# EAGLE design HV Board rev12 (EAGLE 9.6.2)
ENGINEER: Arvind Srinivasan

## Sheet 1 of 2: GLV Systems (Main IO, LEDs, Power, Current Sensors, AIRs, and BMS)
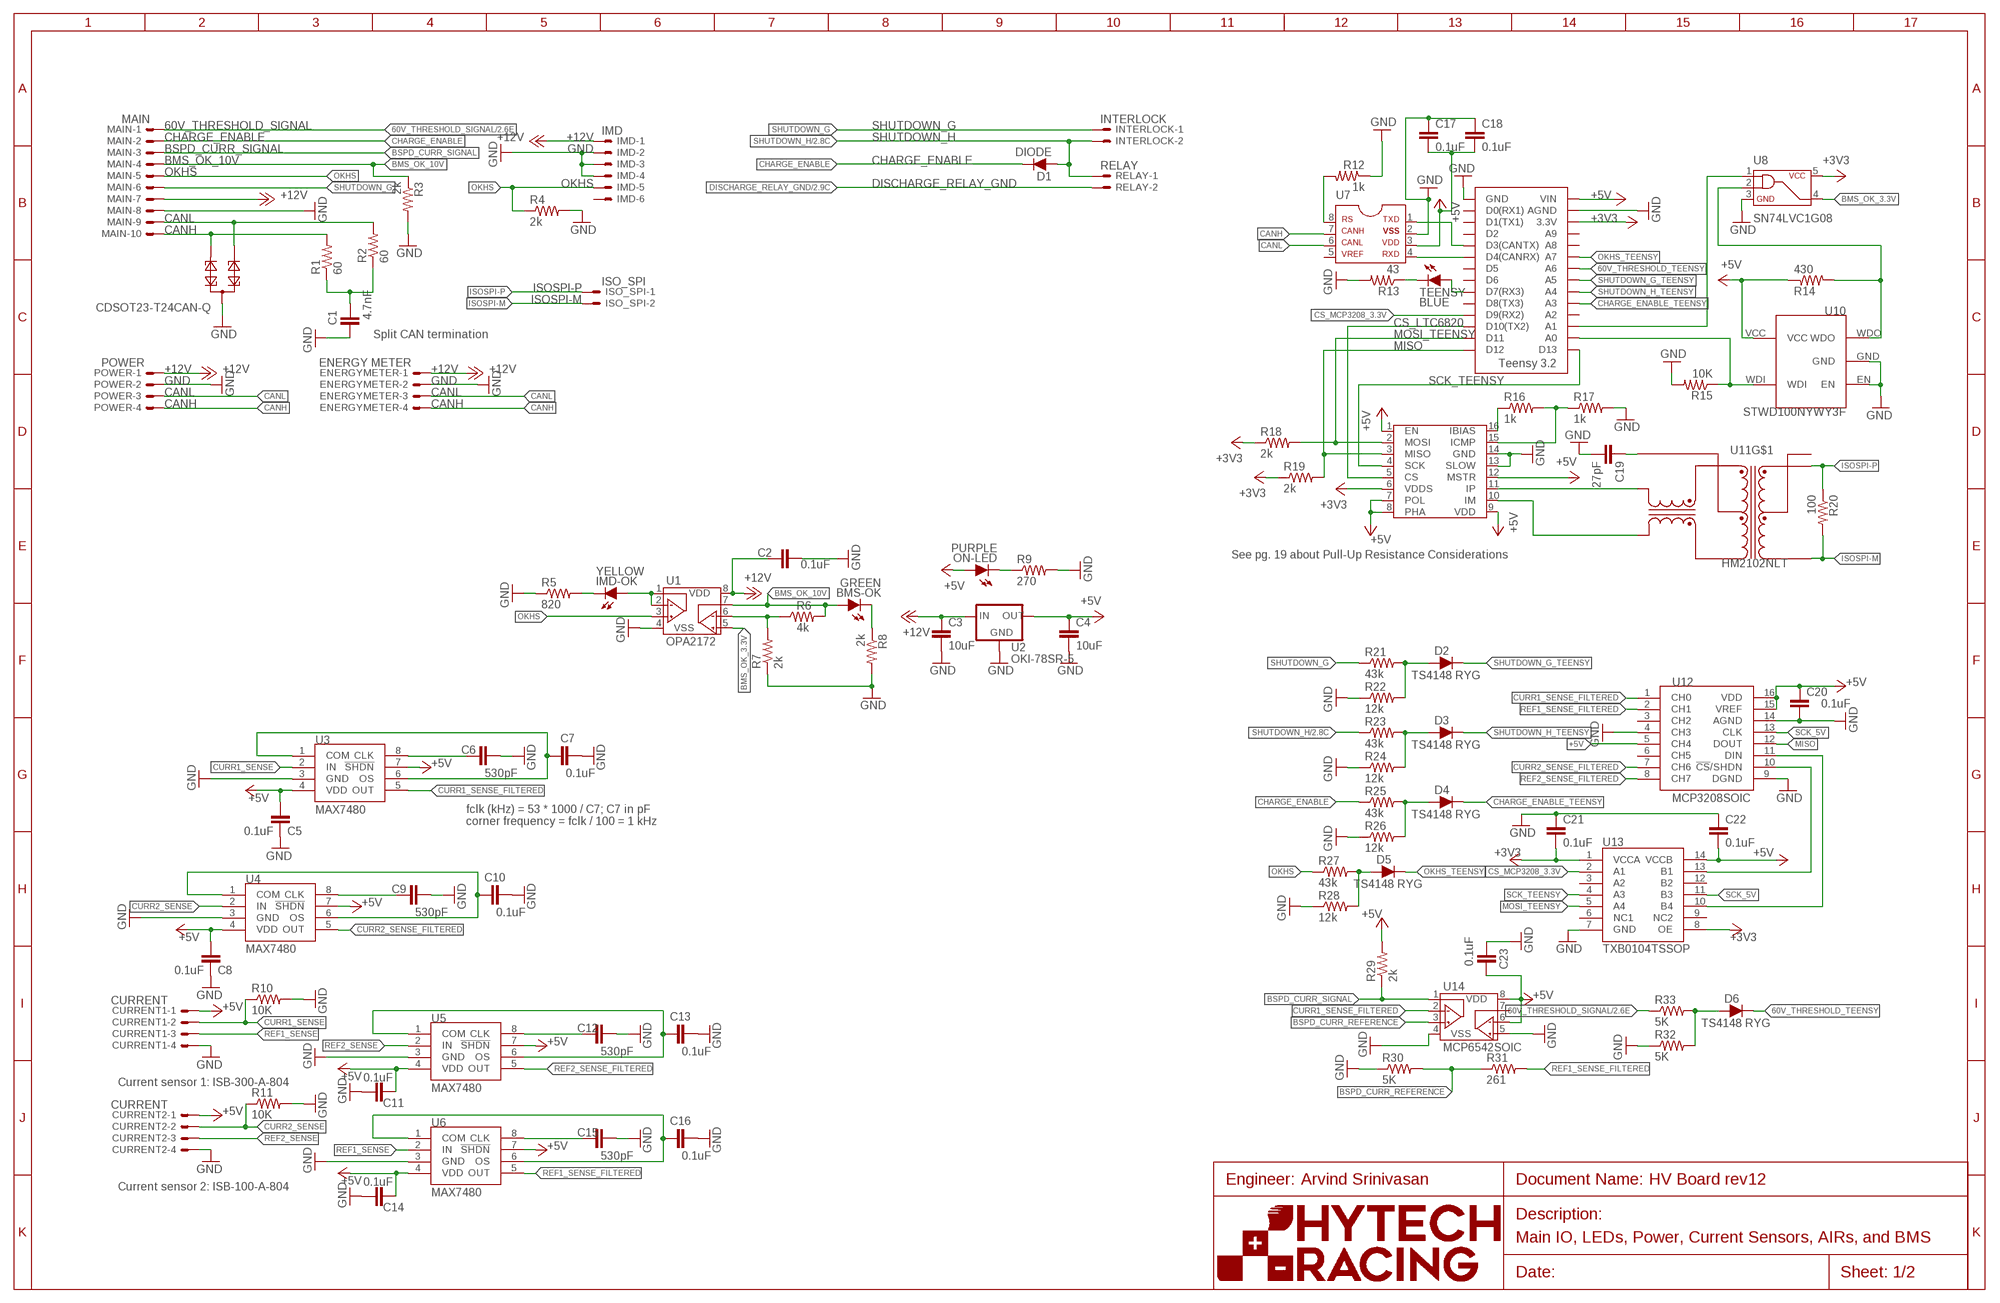
[diagram p0: schematic, sheet 1]
U$1 (FRAME_B): FRAME_DESCRIPTION: Main IO, LEDs, Power, Current Sensors, AIRs, and BMS; ORIENTATION: LANDSCAPE; SIZE: B

### Parts
BMS-OK  GREEN  LED-0805  [LED-805]
C1  4.7nF  CAP0603-CAP  [0603-CAP]
C2  0.1uF  CAP0603-CAP  [0603-CAP]
C3  10uF  CAP0603-CAP  [0603-CAP]
C4  10uF  CAP0603-CAP  [0603-CAP]
C5  0.1uF  CAP0603-CAP  [0603-CAP]
C6  530pF  CAP0603-CAP  [0603-CAP]
C7  0.1uF  CAP0603-CAP  [0603-CAP]
C8  0.1uF  CAP0603-CAP  [0603-CAP]
C9  530pF  CAP0603-CAP  [0603-CAP]
C10  0.1uF  CAP0603-CAP  [0603-CAP]
C11  0.1uF  CAP0603-CAP  [0603-CAP]
C12  530pF  CAP0603-CAP  [0603-CAP]
C13  0.1uF  CAP0603-CAP  [0603-CAP]
C14  0.1uF  CAP0603-CAP  [0603-CAP]
C15  530pF  CAP0603-CAP  [0603-CAP]
C16  0.1uF  CAP0603-CAP  [0603-CAP]
C17  0.1uF  CAP0603-CAP  [0603-CAP]
C18  0.1uF  CAP0603-CAP  [0603-CAP]
C19  27pF  CAP0603-CAP  [0603-CAP]
C20  0.1uF  CAP0603-CAP  [0603-CAP]
C21  0.1uF  CAP0603-CAP  [0603-CAP]
C22  0.1uF  CAP0603-CAP  [0603-CAP]
C23  0.1uF  CAP0603-CAP  [0603-CAP]
CURRENT1  CURRENT  CONNECTOR-4NANO-FIT-VERTICAL-4  [NANO-FIT_VERTICAL-4]
CURRENT2  CURRENT  CONNECTOR-4NANO-FIT-VERTICAL-4  [NANO-FIT_VERTICAL-4]
D1  DIODE  DIODEDO-41  [DO-41]
D2  TS4148 RYG  DIODE0805  [0805_D]
D3  TS4148 RYG  DIODE0805  [0805_D]
D4  TS4148 RYG  DIODE0805  [0805_D]
D5  TS4148 RYG  DIODE0805  [0805_D]
D6  TS4148 RYG  DIODE0805  [0805_D]
ENERGYMETER  ENERGY METER  CONNECTOR-4NANO-FIT-VERTICAL-4  [NANO-FIT_VERTICAL-4]
IMD  IMD  CONNECTOR-6NANO-FIT_VERTICAL-6  [NANO-FIT_VERTICAL-6]
IMD-OK  YELLOW  LED-0805  [LED-805]
INTERLOCK  INTERLOCK  CONNECTOR-2NANO-FIT_VERTICAL-2  [NANO-FIT_VERTICAL-2]
ISO_SPI  ISO_SPI  CONNECTOR-2NANO-FIT_VERTICAL-2  [NANO-FIT_VERTICAL-2]
MAIN  MAIN  CONNECTOR-10NANO-FIT_VERTICAL-10  [NANO-FIT_VERTICAL-10]
ON-LED  PURPLE  LED-0805  [LED-805]
POWER  POWER  CONNECTOR-4NANO-FIT-VERTICAL-4  [NANO-FIT_VERTICAL-4]
R1  60  RESISTOR0603-RES  [0603-RES]
R2  60  RESISTOR0603-RES  [0603-RES]
R3  2k  RESISTOR0603-RES  [0603-RES]
R4  2k  RESISTOR0603-RES  [0603-RES]
R5  820  RESISTOR0603-RES  [0603-RES]
R6  4k  RESISTOR0603-RES  [0603-RES]
R7  2k  RESISTOR0603-RES  [0603-RES]
R8  2k  RESISTOR0603-RES  [0603-RES]
R9  270  RESISTOR0603-RES  [0603-RES]
R10  10K  RESISTOR0603-RES  [0603-RES]
R11  10K  RESISTOR0603-RES  [0603-RES]
R12  1k  RESISTOR0603-RES  [0603-RES]
R13  43  RESISTOR0603-RES  [0603-RES]
R14  430  RESISTOR0603-RES  [0603-RES]
R15  10K  RESISTOR0603-RES  [0603-RES]
R16  1k  RESISTOR0603-RES  [0603-RES]
R17  1k  RESISTOR0603-RES  [0603-RES]
R18  2k  RESISTOR0603-RES  [0603-RES]
R19  2k  RESISTOR0603-RES  [0603-RES]
R20  100  RESISTOR0603-RES  [0603-RES]
R21  43k  RESISTOR0603-RES  [0603-RES]
R22  12k  RESISTOR0603-RES  [0603-RES]
R23  43k  RESISTOR0603-RES  [0603-RES]
R24  12k  RESISTOR0603-RES  [0603-RES]
R25  43k  RESISTOR0603-RES  [0603-RES]
R26  12k  RESISTOR0603-RES  [0603-RES]
R27  43k  RESISTOR0603-RES  [0603-RES]
R28  12k  RESISTOR0603-RES  [0603-RES]
R29  2k  RESISTOR0603-RES  [0603-RES]
R30  5K  RESISTOR0603-RES  [0603-RES]
R31  261  RESISTOR0603-RES  [0603-RES]
R32  5K  RESISTOR0603-RES  [0603-RES]
R33  5K  RESISTOR0603-RES  [0603-RES]
RELAY  RELAY  CONNECTOR-2NANO-FIT_VERTICAL-2  [NANO-FIT_VERTICAL-2]
TEENSY  BLUE  LED-0805  [LED-805]
TEENSY3.2  TEENSY_3.2_SIMPLE  [TEENSY_3.2_SIMPLE]
U1  OPA2172  OPAMP_2_CHANNELSOIC  [SOIC-08]
U2  OKI-78SR-5  [OKI-78SR]
U3  MAX7480  [SOIC-08]
U4  MAX7480  [SOIC-08]
U5  MAX7480  [SOIC-08]
U6  MAX7480  [SOIC-08]
U7  MCP2551  [SOIC-08]
U8  SN74LVC1G08  [SOT-23-5]
U9  LTC6820  [MSOP-16]
U10  STWD100NYWY3F  [SOT23-5]
U11  HM2102NLT  [HM2102NLT]
U12  MCP3208SOIC  [SOIC-16]
U13  TXB0104TSSOP  [TSSOP-14]
U14  MCP6542SOIC  [SOIC-08]
U18  CDSOT23-T24CAN-Q  [SOT23]

### Nets
60V_THRESHOLD_SIGNAL: MAIN.P$1 R33.1 ; also sheet 2
60V_THRESHOLD_TEENSY: D6.C TEENSY3.2.A6
+3V3: C21.1 R18.1 R19.1 TEENSY3.2.3.3V U8.5 U9.6(VDDS) U13.1(VCCA) U13.8(OE)
+5V: C4.1 C5.1 C8.1 C11.1 C14.1 C17.1 C18.1 C20.1 C22.1 C23.1 CURRENT1.P$1 CURRENT2.P$1 ON-LED.A R14.1 R29.2 TEENSY3.2.VIN U2.3(OUT) U3.4(VDD) U3.7(!SHDN) U4.4(VDD) U4.7(!SHDN) U5.4(VDD) U5.7(!SHDN) U6.4(VDD) U6.7(!SHDN) U7.3 U9.1(EN) U9.7(POL) U9.8(PHA) U9.9(VDD) U9.12(MSTR) U10.VCC U12.5(CH4) U12.15(VREF) U12.16(VDD) U13.14(VCCB) U14.6(VINB-) U14.8(VDD) ; also sheet 2
+12V: C2.1 C3.1 ENERGYMETER.P$1 IMD.P$1 MAIN.P$7 POWER.P$1 U1.8(VDD) U2.1(IN) ; also sheet 2
BMS_OK_3.3V: U1.5(VINB+) U8.4
BMS_OK_10V: BMS-OK.A MAIN.P$4 R3.1 R6.2 U1.7(VOUTB)
BSPD_CURR_REFERENCE: R30.2 R31.1 U14.3(VINA+)
BSPD_CURR_SIGNAL: MAIN.P$3 R29.1 U14.1(VOUTA)
CANH: ENERGYMETER.P$4 MAIN.P$10 POWER.P$4 R1.2 U7.7 U18.2
CANL: ENERGYMETER.P$3 MAIN.P$9 POWER.P$3 R2.2 U7.6 U18.1
CHARGE_ENABLE: D1.C MAIN.P$2 R25.1
CHARGE_ENABLE_TEENSY: D4.C TEENSY3.2.A3
CS_LTC6820: TEENSY3.2.D10(TX2) U9.5(CS)
CS_MCP3208_3.3V: TEENSY3.2.D9(RX2) U13.2(A1)
CURR1_SENSE: CURRENT1.P$2 R10.1 U3.2(IN)
CURR1_SENSE_FILTERED: U3.5(OUT) U12.1(CH0) U14.2(VINA-)
CURR2_SENSE: CURRENT2.P$2 R11.1 U4.2(IN)
CURR2_SENSE_FILTERED: U4.5(OUT) U12.7(CH6)
DISCHARGE_RELAY_GND: RELAY.P$2 ; also sheet 2
GND: C1.1 C2.2 C3.2 C4.2 C5.2 C6.2 C7.2 C8.2 C9.2 C10.2 C11.2 C12.2 C13.2 C14.2 C15.2 C16.2 C17.2 C18.2 C19.2 C20.2 C21.2 C22.2 C23.2 CURRENT1.P$4 CURRENT2.P$4 ENERGYMETER.P$2 IMD.P$2 IMD.P$3 IMD.P$4 MAIN.P$8 POWER.P$2 R3.2 R4.2 R5.1 R7.1 R8.2 R9.2 R10.2 R11.2 R12.1 R13.2 R15.2 R17.2 R22.1 R24.1 R26.1 R28.1 R30.1 R32.1 TEENSY3.2.AGND TEENSY3.2.GND U1.4(VSS) U2.2(GND) U3.3(GND) U4.3(GND) U5.3(GND) U6.3(GND) U7.2 U8.3 U9.13(SLOW) U9.14(GND) U10.EN U10.GND U12.4(CH3) U12.9(DGND) U12.14(AGND) U13.7(GND) U14.4(VSS) U14.5(VINB+) U18.3 ; also sheet 2
IM: U9.10(IM) U11.P$10(TD-)
IP: U9.11(IP) U11.P$12(TD+)
ISOSPI-M [ISO_SPI]: ISO_SPI.P$2 R20.2 U11.P$3(MX-)
ISOSPI-P [ISO_SPI]: ISO_SPI.P$1 R20.1 U11.P$1(MX+)
MISO: R19.2 TEENSY3.2.D12 U9.3(MISO) U12.12(DOUT)
MOSI_5V: U12.11(DIN) U13.10(B4)
MOSI_TEENSY: R18.2 TEENSY3.2.D11 U9.2(MOSI) U13.5(A4)
N$2: C7.1 U3.1(COM) U3.6(OS)
N$3: ON-LED.C R9.1
N$4: C6.1 U3.8(CLK)
N$7: U12.10(!CS!/SHDN) U13.13(B1)
N$8: D2.A R21.2 R22.2
N$9: D4.A R25.2 R26.2
N$10: D6.A R32.2 R33.2
N$11: C1.2 R1.1 R2.1
N$12: R6.1 R7.2 U1.6(VINB-)
N$13: D3.A R23.2 R24.2
N$21: D5.A R27.2 R28.2
N$25: TEENSY3.2.D3(CANTX) U7.1
N$26: R12.2 U7.8
N$29: R13.1 TEENSY.C
N$31: R16.1 U9.16(IBIAS)
N$32: R16.2 R17.1 U9.15(ICMP)
N$35: C19.1 U11.P$11(TCT)
N$36: TEENSY3.2.D4(CANRX) U7.4
N$37: TEENSY3.2.D7(RX3) TEENSY.A
N$38: R14.2 U8.2 U10.WDO
N$40: TEENSY3.2.A1 U8.1
N$42: IMD-OK.A U1.1(VOUTA) U1.2(VINA-)
N$44: BMS-OK.C R8.1
N$45: IMD-OK.C R5.2
N$48: C16.1 U6.1(COM) U6.6(OS)
N$49: C15.1 U6.8(CLK)
N$50: R15.1 TEENSY3.2.A0 U10.WDI
N$51: C10.1 U4.1(COM) U4.6(OS)
N$52: C9.1 U4.8(CLK)
N$53: C13.1 U5.1(COM) U5.6(OS)
N$54: C12.1 U5.8(CLK)
OKHS: IMD.P$5 MAIN.P$5 R4.1 R27.1 U1.3(VINA+)
OKHS_TEENSY: D5.C TEENSY3.2.A7
REF1_SENSE: CURRENT1.P$3 U6.2(IN)
REF1_SENSE_FILTERED: R31.2 U6.5(OUT) U12.2(CH1)
REF2_SENSE: CURRENT2.P$3 U5.2(IN)
REF2_SENSE_FILTERED: U5.5(OUT) U12.8(CH7)
SCK_5V: U12.13(CLK) U13.11(B3)
SCK_TEENSY: TEENSY3.2.D13 U9.4(SCK) U13.4(A3)
SHUTDOWN_G: INTERLOCK.P$1 MAIN.P$6 R21.1
SHUTDOWN_G_TEENSY: D2.C TEENSY3.2.A5
SHUTDOWN_H: D1.A INTERLOCK.P$2 R23.1 RELAY.P$1 ; also sheet 2
SHUTDOWN_H_TEENSY: D3.C TEENSY3.2.A4
Unconnected: IMD.P$6 TEENSY3.2.A2 TEENSY3.2.A8 TEENSY3.2.A9 TEENSY3.2.D0(RX1) TEENSY3.2.D1(TX1) TEENSY3.2.D2 TEENSY3.2.D5 TEENSY3.2.D6 TEENSY3.2.D8(TX3) U7.5 U11.P$2(MCT) U11.P$4(MX+) U11.P$5(MCT) U11.P$6(MX-) U11.P$7(TD-) U11.P$8(TCT) U11.P$9(TD+) U12.3(CH2) U12.6(CH5) U13.3(A2) U13.6(NC1) U13.9(NC2) U13.12(B2) U14.7(VOUTB)

### Notes on the sheet
- Split CAN termination
- See pg. 19 about Pull-Up Resistance Considerations
- fclk (kHz) = 53 * 1000 / C7; C7 in pF
  corner frequency = fclk / 100 = 1 kHz
- Current sensor 1: ISB-300-A-804
- Current sensor 2: ISB-100-A-804

## Sheet 2 of 2: HV Systems (Discharge, Precharge, and TSAL/Voltage Indicator)
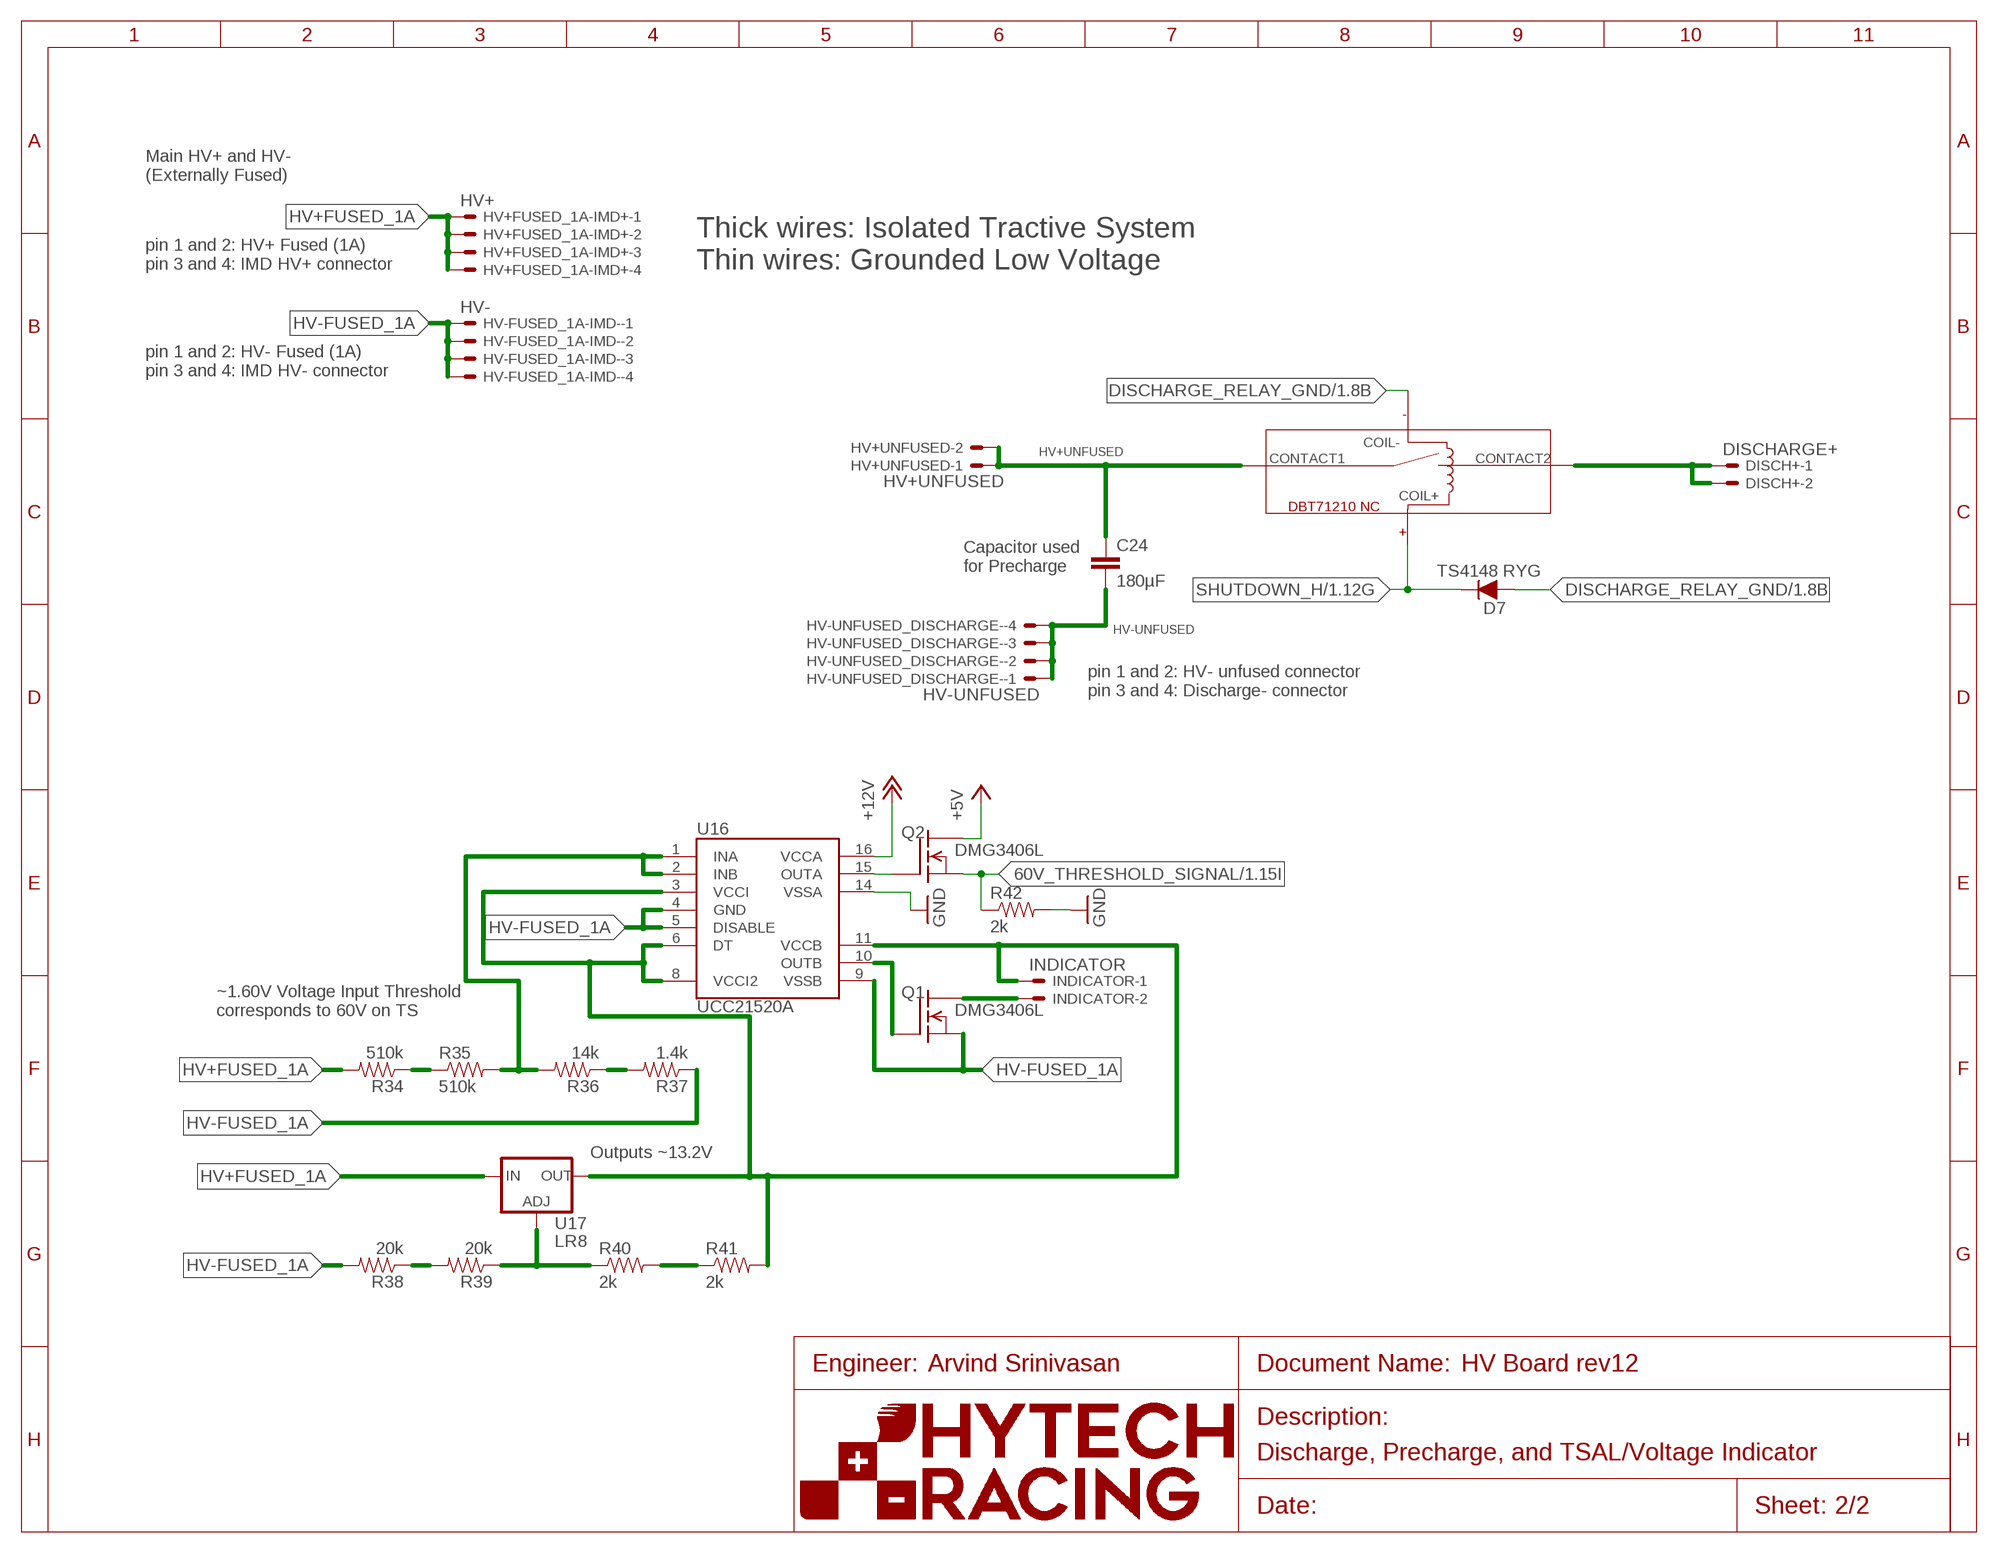
[diagram p1: schematic, sheet 2]
U$2 (FRAME_A): FRAME_DESCRIPTION: Discharge, Precharge, and TSAL/Voltage Indicator; ORIENTATION: LANDSCAPE; SIZE: A

### Parts
C24  180µF  CAP  [LLS2V221MELZ]
D7  TS4148 RYG  DIODE0805  [0805_D]
DISCH+  DISCHARGE+  CONNECTOR-2NANO-FIT_VERTICAL-2  [NANO-FIT_VERTICAL-2]
HV+FUSED_1A-IMD+  HV+  CONNECTOR-4NANO-FIT-VERTICAL-4  [NANO-FIT_VERTICAL-4]
HV+UNFUSED  HV+UNFUSED  CONNECTOR-2NANO-FIT_VERTICAL-2  [NANO-FIT_VERTICAL-2]
HV-FUSED_1A-IMD-  HV-  CONNECTOR-4NANO-FIT-VERTICAL-4  [NANO-FIT_VERTICAL-4]
HV-UNFUSED_DISCHARGE-  HV-UNFUSED  CONNECTOR-4NANO-FIT-VERTICAL-4  [NANO-FIT_VERTICAL-4]
INDICATOR  INDICATOR  CONNECTOR-2NANO-FIT_VERTICAL-2  [NANO-FIT_VERTICAL-2]
Q1  DMG3406L  DMG3406LSOT  [SOT23]
Q2  DMG3406L  DMG3406LSOT  [SOT23]
R34  510k  RESISTOR0805-RES  [0805]
R35  510k  RESISTOR0805-RES  [0805]
R36  14k  RESISTOR0805-RES  [0805]
R37  1.4k  RESISTOR0805-RES  [0805]
R38  20k  RESISTOR0805-RES  [0805]
R39  20k  RESISTOR0805-RES  [0805]
R40  2k  RESISTOR0805-RES  [0805]
R41  2k  RESISTOR0805-RES  [0805]
R42  2k  RESISTOR0603-RES  [0603-RES]
U15  DBT71210  [DBT71210]
U16  UCC21520A  [SO16-DW]
U17  LR8  HV_LIN_REG_LR8SMD  [TO-252]

### Nets
60V_THRESHOLD_SIGNAL: Q2.2(S) R42.1 ; also sheet 1
+5V: Q2.3(D) ; also sheet 1
+12V: U16.16(VCCA) ; also sheet 1
DISCHARGE_RELAY_GND: D7.A U15.COIL- ; also sheet 1
GND: R42.2 U16.14(VSSA) ; also sheet 1
HV+FUSED_1A [TS]: HV+FUSED_1A-IMD+.P$1 HV+FUSED_1A-IMD+.P$2 HV+FUSED_1A-IMD+.P$3 HV+FUSED_1A-IMD+.P$4 R34.2 U17.1(IN)
HV+UNFUSED [TS]: C24.P$1 HV+UNFUSED.P$1 HV+UNFUSED.P$2 U15.CONTACT1
HV+UNFUSED_FSAE_DISCHARGE [TS]: DISCH+.P$1 DISCH+.P$2 U15.CONTACT2
HV-FUSED_1A [TS]: HV-FUSED_1A-IMD-.P$1 HV-FUSED_1A-IMD-.P$2 HV-FUSED_1A-IMD-.P$3 HV-FUSED_1A-IMD-.P$4 Q1.2(S) R37.1 R38.2 U16.4(GND) U16.5(DISABLE) U16.9(VSSB)
HV-UNFUSED [TS]: C24.P$2 HV-UNFUSED_DISCHARGE-.P$1 HV-UNFUSED_DISCHARGE-.P$2 HV-UNFUSED_DISCHARGE-.P$3 HV-UNFUSED_DISCHARGE-.P$4
N$1: INDICATOR.P$2 Q1.3(D)
N$14: R34.1 R35.1
N$15: R39.1 R40.1 U17.3(ADJ)
N$16: R35.2 R36.2 U16.1(INA) U16.2(INB)
N$17: R36.1 R37.2
N$20: Q2.1(G) U16.15(OUTA)
N$22: Q1.1(G) U16.10(OUTB)
N$23: INDICATOR.P$1 R41.2 U16.3(VCCI) U16.6(DT) U16.8(VCCI2) U16.11(VCCB) U17.2(TAB)(OUT)
N$43: R40.2 R41.1
N$47: R38.1 R39.2
SHUTDOWN_H: D7.C U15.COIL+ ; also sheet 1

### Notes on the sheet
- Main HV+ and HV-
  (Externally Fused)
- pin 1 and 2: HV+ Fused (1A)
  pin 3 and 4: IMD HV+ connector
- Thick wires: Isolated Tractive System
  Thin wires: Grounded Low Voltage
- pin 1 and 2: HV- Fused (1A)
  pin 3 and 4: IMD HV- connector
- Capacitor used
  for Precharge
- pin 1 and 2: HV- unfused connector
  pin 3 and 4: Discharge- connector
- ~1.60V Voltage Input Threshold
  corresponds to 60V on TS
- Outputs ~13.2V

## Library data of the parts
BMS-OK IMD-OK ON-LED TEENSY = HyTechDevices:LED: Light Emitting Diode (LED) Source: Dangerous Prototypes Eagle Library <https://github.com/DangerousPrototypes/Eagle_Part_Library>
C1 = HyTechDevices:CAP: Capacitor Standard 0603 ceramic capacitor, and 0.1" leaded capacitor.; TOLERANCE: 5%; VOLTAGE: 50V
C2 C5 C7 C8 C10 C11 C13 C14 C16-C23 = HyTechDevices:CAP: Capacitor Standard 0603 ceramic capacitor, and 0.1" leaded capacitor.; TOLERANCE: 5%; VOLTAGE: 10V
C3 C4 = HyTechDevices:CAP: Capacitor Standard 0603 ceramic capacitor, and 0.1" leaded capacitor.; TOLERANCE: 5%; VOLTAGE: 25V
C6 C9 C12 C15 = HyTechDevices:CAP: Capacitor Standard 0603 ceramic capacitor, and 0.1" leaded capacitor.; TOLERANCE: 1%; VOLTAGE: 10V
C24 = HyTechDevices:CAP: Capacitor Standard 0603 ceramic capacitor, and 0.1" leaded capacitor.; TOLERANCE: 20%; VOLTAGE: 350V
CURRENT1 CURRENT2 ENERGYMETER HV+FUSED_1A-IMD+ HV-FUSED_1A-IMD- HV-UNFUSED_DISCHARGE- POWER = HyTechDevices:CONNECTOR-4: Mini-Fit Junior connector 4 pole Source: http://www.molex.com
D1-D7 = HyTechDevices:DIODE: DIODE general purpose rectifier
DISCH+ HV+UNFUSED INDICATOR INTERLOCK ISO_SPI RELAY = HyTechDevices:CONNECTOR-2: Mini-Fit Junior connector 2 pole Source: http://www.molex.com
IMD = HyTechDevices:CONNECTOR-6: Mini-Fit Junior connector 6 pole Source: http://www.molex.com
MAIN = HyTechDevices:CONNECTOR-10: Mini-Fit Junior connector 10 pole Source: http://www.molex.com
Q1 Q2 = HyTechDevices:DMG3406L: Generic NPN MOSFET DMG3406L (SOT-23, 2.8 A 30V)
R1-R19 R21-R42 = HyTechDevices:RESISTOR: Resistor Basic schematic elements and footprints for 0603, 1206, and PTH resistors.; TOLERANCE: 1%
R20 = HyTechDevices:RESISTOR: Resistor Basic schematic elements and footprints for 0603, 1206, and PTH resistors.; TOLERANCE: 1%; TYPE: TERMINATION
TEENSY3.2 = HyTechDevices:TEENSY_3.2_SIMPLE: Simple version of the Teensy 3.2 board that only uses the 2 main rows of pins, not the inner pins or the pins opposite the usb port.
U1 = HyTechDevices:OPAMP_2_CHANNEL: TI NE5532 Dual Channel Op Amp
U2 = HyTechDevices:OKI-78SR-5: Murata OKI-78SR 5V 1.5A Non-Isolated Switching Regulator DC/DC - Datasheet <https://power.murata.com/data/power/oki-78sr.pdf>
U3-U6 = HyTechDevices:MAX7480: 8th-order lowpass butterworth filter
U7 = HyTechDevices:MCP2551: MCP2551 High-Speed CAN Transceiver Product Webpage <https://www.microchip.com/wwwproducts/en/MCP2551> Datasheet <http://ww1.microchip.com/downloads/en/DeviceDoc/21667f.pdf> This device is outdated It is replaced by MCP2561. Comparison Page <https://www.microchip.com/wwwproducts/ProductCompare/MCP2551/MCP2561> Product Webpage <https://www.microchip.com/wwwproducts/en/MCP2561> Datasheet <http://ww1.microchip.com/downloads/en/DeviceDoc/20005167C.pdf>
U8 = HyTechDevices:SN74LVC1G08: TI SN74LVC1G08 SINGLE 2-INPUT POSITIVE-AND GATE Datasheet <http://www.ti.com/lit/ds/sces556f/sces556f.pdf>
U9 = HyTechDevices:LTC6820: Linear Technology isoSPI Isolated Communications Interface Datasheet <http://cds.linear.com/docs/en/datasheet/6820fb.pdf>
U10 = HyTechDevices:STWD100NYWY3F: STWD100 Watchdog Timer (open-drain configuration) Datasheet <https://www.st.com/resource/en/datasheet/stwd100.pdf>
U11 = HyTechDevices:HM2102NLT: 2 Channel SMT Transformer Turns ratio: 1CT: 1CT Isolation Voltage: 4300 VDC Inductance: 150 uH Leakage Inductance: 0.50 uH max DataSheet <https://www.mouser.com/datasheet/2/336/HM2102NL-1218600.pdf>
U12 = HyTechDevices:MCP3208: Analog to Digital Converter
U13 = HyTechDevices:TXB0104: Texas Instruments TXB0104 4-channel low voltage to high voltage Logic Level Shifter. Minimum input voltage level 1.8V. Maximum output voltage level 5.5V.
U14 = HyTechDevices:MCP6542: Microchip MCP6542 Dual Channel Push-Pull Comparator
U15 = HyTechDevices:DBT71210: DBT71210 Reed Relay Form B (Standard normally closed), switch 12V
U16 = HyTechDevices:UCC21520A: UCC21520A Datasheet <http://www.ti.com/lit/ds/symlink/ucc21520-q1.pdf>
U17 = HyTechDevices:HV_LIN_REG_LR8
U18 = HyTechDevices:CDSOT23-T24CAN-Q: CAN Bus dual TVS array for transceiver ESD and surge protection

## Net classes
1 TS: clearance 2.25 mm to class 0
2 ISO_SPI: clearance 2.25 mm to class 0, clearance 2.25 mm to class 1

## Board
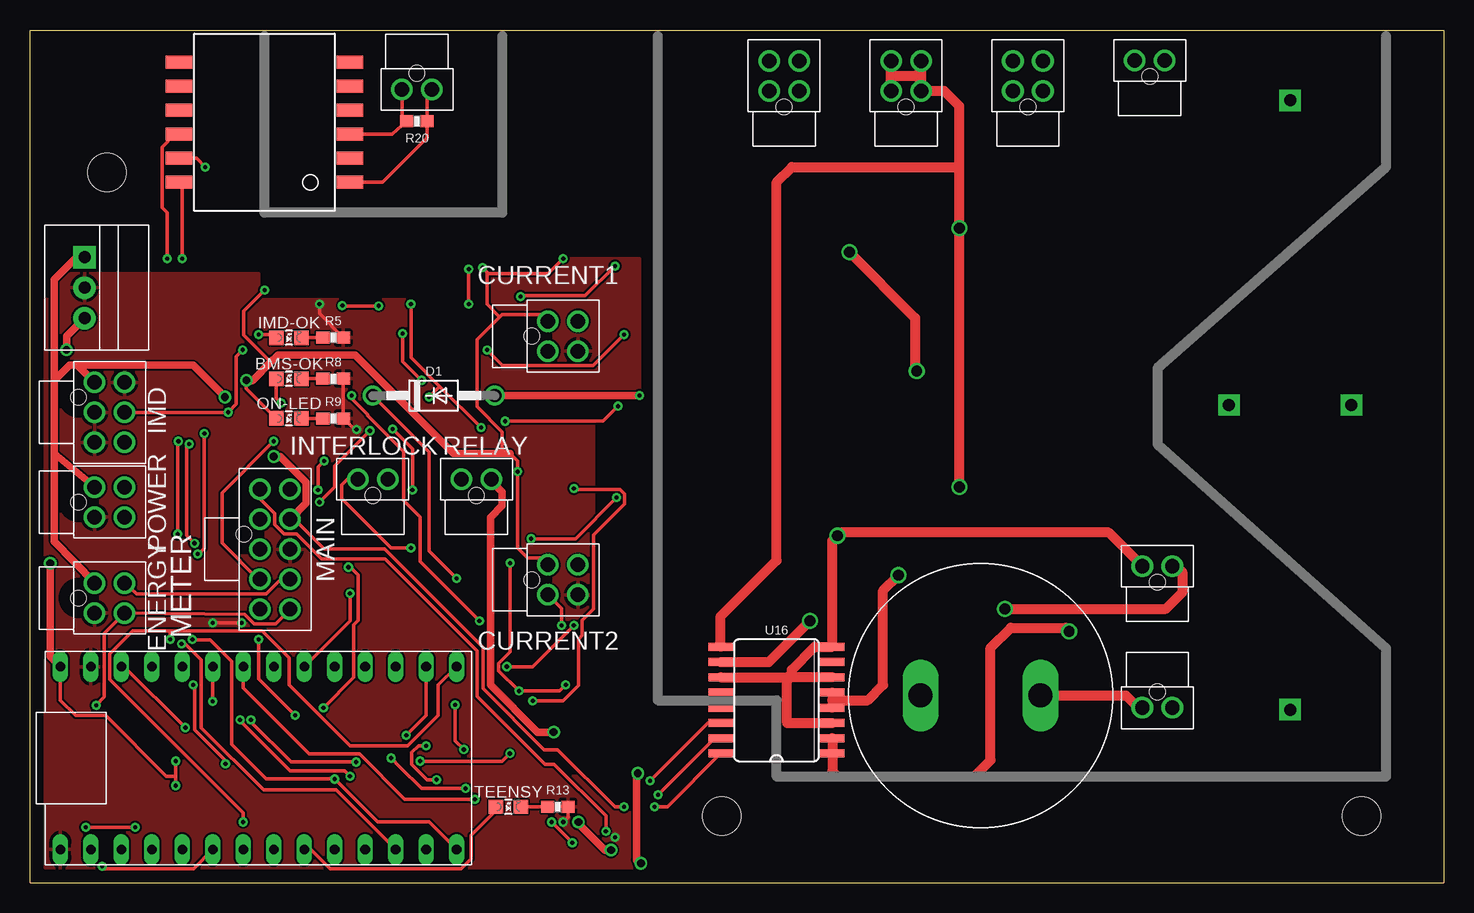
[diagram p2: board, top side]
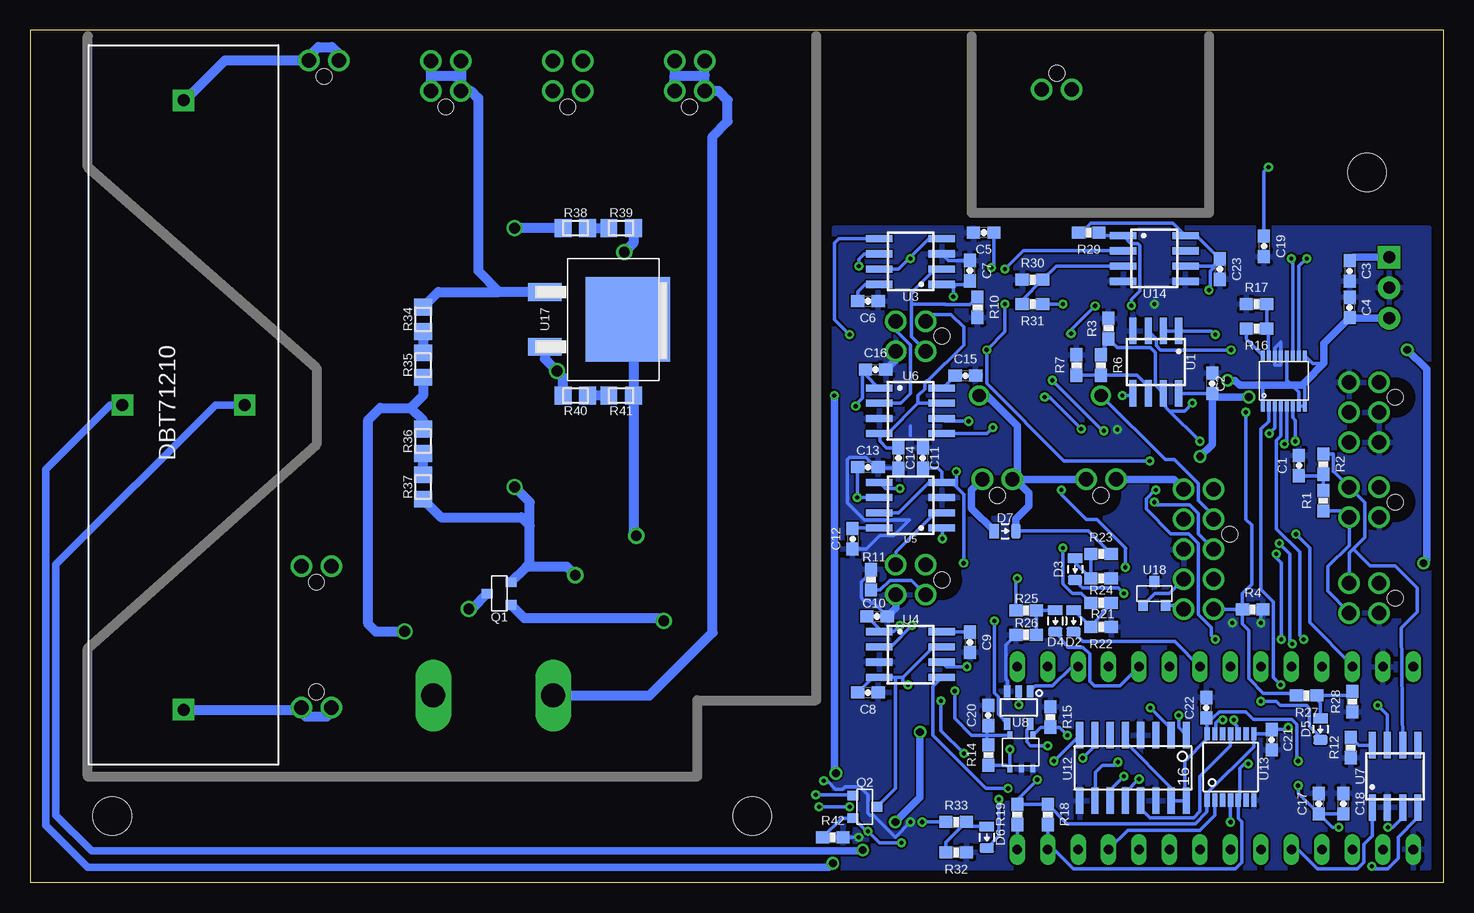
[diagram p3: board, bottom side, seen from below]

Size 117.86 x 71.12 mm. Coordinates in mm from the lower left corner, seen from the top.
Outline: 0,0 117.86,0 117.86,71.12 0,71.12 0,0
Copper layers (1*16): Top 0.035mm / dielectric 1.5mm / Bottom 0.035mm
Design rules "DRC Advanced Circuits": minimum track width 6mil, minimum drill 10mil, track to track 6mil, track to pad 6mil, pad to pad 6mil, via to via 6mil, smd to smd 6mil, copper to edge 40mil, drill to drill 6mil, minimum pad ring 10mil, minimum via ring 8mil, stop-mask expansion 4mil, vias tented up to drill 0mil, thermal gap 10mil
Holes 3.2 mm at 6.4,59.23 111,5.59 57.66,5.59
tRestrict: area 3.4,56.2 to 9.4,62.2; area 54.7,2.6 to 60.7,8.6; area 108,2.6 to 114,8.6

### Footprints (pad centres in the part's own frame; a part is rotated, then mirrored left to right if it is on the bottom)
LED-805 = smd 1.2 x 1.2: A 0,-1.05; C 0,1.05
0603-CAP = smd 1.1 x 1: 1 -0.85,0; 2 0.85,0
LLS2V221MELZ = drill 2 long: P$1 -5,0; P$2 5,0
NANO-FIT_VERTICAL-4 = drill 1.2: P$1 -1.25,0; P$2 1.25,0; P$3 -1.25,2.5; P$4 1.25,2.5 | hole 1.3: 0,-1.34
DO-41 = drill 1.118: A 5.08,0; C -5.08,0
0805_D = smd 0.8 x 1.2: A -0.9,0; C 0.9,0
NANO-FIT_VERTICAL-2 = drill 1.2: P$1 -1.25,0; P$2 1.25,0 | hole 1.3: 0,-1.34
NANO-FIT_VERTICAL-6 = drill 1.2: P$1 -2.5,0; P$2 0,0; P$3 2.5,0; P$4 -2.5,2.5; P$5 0,2.5; P$6 2.5,2.5 | hole 1.3: -1.25,-1.34
NANO-FIT_VERTICAL-10 = drill 1.2: P$1 -5,0; P$2 -2.5,0; P$3 0,0; P$4 2.5,0; P$5 5,0; P$6 -5,2.5; P$7 -2.5,2.5; P$8 0,2.5; P$9 2.5,2.5; P$10 5,2.5 | hole 1.3: -1.27,-1.34
SOT23 = smd 0.8 x 0.9: 1 -0.95,-1; 2 0.95,-1; 3 0,1
0603-RES = smd 1.1 x 1: 1 -0.85,0; 2 0.85,0
0805 = smd 1.4 x 1.5: 1 -1.025,0; 2 1.025,0
TEENSY_3.2_SIMPLE = drill 0.8 long: 3.3V 16.51,29.21; A0 16.51,3.81; A1 16.51,6.35; A2 16.51,8.89; A3 16.51,11.43; A4 16.51,13.97; A5 16.51,16.51; A6 16.51,19.05; A7 16.51,21.59; A8 16.51,24.13; A9 16.51,26.67; AGND 16.51,31.75; D0(RX1) 1.27,31.75; D1(TX1) 1.27,29.21; D2 1.27,26.67; D3(CANTX) 1.27,24.13; D4(CANRX) 1.27,21.59; D5 1.27,19.05; D6 1.27,16.51; D7(RX3) 1.27,13.97; D8(TX3) 1.27,11.43; D9(RX2) 1.27,8.89; D10(TX2) 1.27,6.35; D11 1.27,3.81; D12 1.27,1.27; D13 16.51,1.27; GND 1.27,34.29; VIN 16.51,34.29
SOIC-08 = smd 0.6 x 2.2: 1 -1.905,-2.6; 2 -0.635,-2.6; 3 0.635,-2.6; 4 1.905,-2.6; 5 1.905,2.6; 6 0.635,2.6; 7 -0.635,2.6; 8 -1.905,2.6
OKI-78SR = drill 1 pad 1.88 square: 1 -2.54,0 | drill 1 pad 1.88: 2 0,0; 3 2.54,0
SOT-23-5 = smd 1 x 0.55: 1 -1.35,0.95; 2 -1.35,0; 3 -1.35,-0.95; 4 1.35,-0.95; 5 1.35,0.95
MSOP-16 = smd 0.305 x 0.889: 1 -0.1,-0.5; 2 0.4,-0.5; 3 0.9,-0.5; 4 1.4,-0.5; 5 1.9,-0.5; 6 2.4,-0.5; 7 2.9,-0.5; 8 3.4,-0.5; 9 3.4,3.7; 10 2.9,3.7; 11 2.4,3.7; 12 1.9,3.7; 13 1.4,3.7; 14 0.9,3.7; 15 0.4,3.7; 16 -0.1,3.7
SOT23-5 = smd 0.61 x 0.406: EN -2.794,0; GND -2.794,0.94; VCC 0,1.905; WDI 0,0; WDO -2.794,1.905
HM2102NLT = smd 1.067 x 2.184: P$1 0,0; P$2 2,0; P$3 4,0; P$4 6,0; P$5 8,0; P$6 10,0; P$7 10,14.25; P$8 8,14.25; P$9 6,14.25; P$10 4,14.25; P$11 2,14.25; P$12 0,14.25
SOIC-16 = smd 0.6 x 2.2: 1 -4.445,-2.794; 2 -3.175,-2.794; 3 -1.905,-2.794; 4 -0.635,-2.794; 5 0.635,-2.794; 6 1.905,-2.794; 7 3.175,-2.794; 8 4.445,-2.794; 9 4.445,2.667; 10 3.175,2.667; 11 1.905,2.667; 12 0.635,2.667; 13 -0.635,2.667; 14 -1.905,2.667; 15 -3.175,2.667; 16 -4.445,2.667
TSSOP-14 = smd 0.45 x 1.1: 1 -1.958,-2.618; 2 -1.308,-2.618; 3 -0.657,-2.618; 4 -0.007,-2.618; 5 0.642,-2.618; 6 1.292,-2.618; 7 1.942,-2.618; 8 1.942,2.918; 9 1.292,2.918; 10 0.642,2.918; 11 -0.007,2.918; 12 -0.657,2.918; 13 -1.308,2.918; 14 -1.958,2.918
DBT71210 = drill 1 pad 1.778 square: COIL+ 30,-13; COIL- 30,-2.8; CONTACT1 55.4,-7.9; CONTACT2 4.6,-7.9
SO16-DW = smd 0.66 x 2.032: 1 -4.445,-4.65; 2 -3.175,-4.65; 3 -1.905,-4.65; 4 -0.635,-4.65; 5 0.635,-4.65; 6 1.905,-4.65; 7 3.175,-4.65; 8 4.445,-4.65; 9 4.445,4.65; 10 3.175,4.65; 11 1.905,4.65; 12 0.635,4.65; 13 -0.635,4.65; 14 -1.905,4.65; 15 -3.175,4.65; 16 -4.445,4.65
TO-252 = smd 1.499 x 2.794: 1 -2.286,0; 3 2.286,0 | smd 7.01 x 7.01: 2(TAB) 0,6.909

### Placement (x,y rotation side)
BMS-OK  21.59,42.04 270 top
C1  12.06,34.8 270 bottom
C2  19.3,41.66 90 bottom
C3  7.85,51.03 270 bottom
C4  7.85,47.98 90 bottom
C5  38.35,54.23 180 bottom
C6  48.01,48.51 0 bottom
C7  39.5,51.05 90 bottom
C8  48.01,15.88 0 bottom
C9  39.5,20.07 270 bottom
C10  47.24,22.23 0 bottom
C11  43.43,35.43 90 bottom
C12  49.28,28.7 270 bottom
C13  48.01,34.67 0 bottom
C14  45.47,35.43 270 bottom
C15  39.88,42.29 0 bottom
C16  47.37,42.8 0 bottom
C17  10.41,6.6 90 bottom
C18  8.38,6.6 90 bottom
C19  14.99,53.09 270 bottom
C20  37.97,13.97 90 bottom
C21  14.35,11.94 270 bottom
C22  19.81,14.61 90 bottom
C23  18.67,51.18 270 bottom
C24  79.24,15.62 180 top
CURRENT1  43.18,45.59 270 top
CURRENT2  43.18,25.27 270 top
D1  33.66,40.64 0 top
D2  30.86,21.84 270 bottom
D3  30.73,26.16 270 bottom
D4  32.38,21.84 270 bottom
D5  10.29,12.83 270 bottom
D6  38.1,3.81 270 bottom
D7  36.58,29.34 0 bottom
DISCH+  93.34,68.58 0 top
ENERGYMETER  5.38,23.75 270 top
HV+FUSED_1A-IMD+  83.19,66.04 0 top
HV+UNFUSED  93.98,14.61 180 top
HV-FUSED_1A-IMD-  73.03,66.04 0 top
HV-UNFUSED_DISCHARGE-  62.87,66.04 0 top
IMD  5.38,39.24 270 top
IMD-OK  21.59,45.47 270 top
INDICATOR  93.98,26.42 0 top
INTERLOCK  28.57,33.66 0 top
ISO_SPI  32.26,66.17 180 top
MAIN  19.18,27.81 270 top
ON-LED  21.59,38.73 270 top
POWER  5.38,31.75 270 top
Q1  78.74,24.13 90 bottom
Q2  48.26,6.35 270 bottom
R1  10.03,31.88 270 bottom
R2  10.03,34.92 90 bottom
R3  27.94,46.23 90 bottom
R4  15.93,22.81 0 bottom
R5  25.27,45.47 180 top
R6  28.57,43.18 90 bottom
R7  30.61,43.18 270 bottom
R8  25.27,42.04 0 top
R9  25.27,38.73 0 top
R10  38.86,48.01 270 bottom
R11  47.75,25.27 90 bottom
R12  7.75,11.3 90 bottom
R13  43.99,6.35 0 top
R14  37.97,10.67 270 bottom
R15  32.79,13.84 90 bottom
R16  15.62,46.23 0 bottom
R17  15.62,48.26 180 bottom
R18  33.02,5.71 270 bottom
R19  35.56,5.71 270 bottom
R20  32.26,63.5 180 top
R21  28.57,23.37 0 bottom
R22  28.57,21.34 180 bottom
R23  28.57,27.43 180 bottom
R24  28.57,25.4 180 bottom
R25  34.8,22.73 0 bottom
R26  34.8,20.7 0 bottom
R27  11.43,15.62 0 bottom
R28  7.62,15.11 90 bottom
R29  29.59,54.23 180 bottom
R30  34.29,50.29 0 bottom
R31  34.29,48.26 0 bottom
R32  40.64,2.54 180 bottom
R33  40.64,5.08 0 bottom
R34  85.09,46.99 90 bottom
R35  85.09,43.18 270 bottom
R36  85.09,36.83 90 bottom
R37  85.09,33.02 90 bottom
R38  72.39,54.61 180 bottom
R39  68.58,54.61 180 bottom
R40  72.39,40.64 0 bottom
R41  68.58,40.64 0 bottom
R42  50.93,3.81 0 bottom
RELAY  37.21,33.66 0 top
TEENSY  39.88,6.35 270 top
TEENSY3.2  36.83,1.52 90 top
U1  24,43.43 180 bottom
U2  4.55,49.63 270 top
U3  44.45,51.82 90 bottom
U4  44.45,19.05 270 bottom
U5  44.45,31.5 90 bottom
U6  44.45,39.37 270 bottom
U7  4.06,8.89 0 bottom
U8  35.43,14.63 270 bottom
U9  14.99,40.26 0 bottom
U10  34.26,12.32 90 bottom
U11  26.67,58.42 90 top
U12  25.91,9.53 180 bottom
U13  17.78,9.53 0 bottom
U14  24.13,52.07 270 bottom
U15  97.16,69.85 270 bottom
U16  62.23,15.24 90 top
U17  74.93,46.99 270 bottom
U18  24.13,24.13 0 bottom

### Tracks (layer width: path | path; a pad name or v marks a point on that pad's centre or on a via)
60V_THRESHOLD_SIGNAL  (via drill 0.35)
  Top 0.305: MAIN.P$1 19.18,32.02 20.38,30.81 20.38,29.9 21.18,29.11 22.23,29.11 24.33,27.01 29.61,27.01 37.28,19.34 37.28,15.55 42.93,9.91 43.69,9.91 48.01,5.59 v48.01,4.32 | v43.48,5.08 v45.21,3.35
  Bottom 0.305: R33.1 v43.48,5.08 | R42.1 50.19,5.4 Q2.2 49.22,5.4 48.13,4.32 v48.01,4.32 47.04,3.35 v45.21,3.35
60V_THRESHOLD_TEENSY  (via drill 0.35)
  Top 0.305: TEENSY3.2.A6 17.78,16.26 23.27,10.76 27.46,10.76 31.24,6.99 v37.08,6.99
  Bottom 0.305: D6.C 37.08,3.93 v37.08,6.99
+3V3  (via drill 0.35)
  Top 0.305: v12.37,36.83 12.32,36.78 v12.32,29.08 | v12.95,12.95 7.87,18.03 TEENSY3.2.3.3V | v33.02,11.43 32.38,11.43 31.83,10.87 31.83,9.88 33.09,8.62 v33.89,8.62
  Bottom 0.305: U9.6 12.59,38.79 12.37,38.57 v12.37,36.83 | v12.32,29.08 11.18,27.94 11.18,21.72 7.62,18.16 TEENSY3.2.3.3V | v33.89,8.62 35.56,6.95 R19.1 R18.1 31.41,4.95 20.7,4.95 19.74,5.92 U13.1 19.74,7.46 15.84,11.36 U13.8 14.7,12.44 C21.1 13.12,12.79 v12.95,12.95 | v33.02,11.43 34.44,11.43 34.77,11.76 34.77,12.75 34.56,12.97 34.56,13.21 U8.5
+5V  (via drill 0.35, 0.65)
  Top 0.305: v4.65,4.63 v8.76,4.63 | CURRENT1.P$1 43.16,46.84 42.59,47.41 39.37,47.41 39.16,47.2 | ON-LED.A 18.03,41.24 v18.03,41.91 | CURRENT2.P$1 43.16,26.52 42.59,27.09 41.49,27.09 40.64,27.94 v40.64,34.29 40.64,35.18 40.01,35.81 | v19.57,49.43 17.83,47.69 17.83,45.67 20.08,43.42 | TEENSY3.2.VIN 2.54,15.24 3.81,13.97 6.29,13.97 11.37,8.89 12.14,8.89 | v12.14,10.16 12.14,8.89 | v44.45,52.07 43.18,50.8 38.1,50.8 | 39.16,47.2 37.25,45.3 37.25,39.71 39.37,37.59 39.37,35.81 | 39.16,47.2 38.1,48.26 38.1,50.8 | v37.72,51.31 38.1,50.93 38.1,50.8 | 12.14,8.89 v12.14,8.12 | v40.02,26.67 40.02,19.27 39.07,18.32 39.07,17.7 v40.77,16 44.15,16 v44.66,16.51
  Top 0.61: TEENSY3.2.VIN 1.69,18.88 v1.69,26.67 | v18.03,41.91 18.57,41.91 20.08,43.42 20.67,44.02 27.11,44.02 35.31,35.81 39.37,35.81 40.01,35.81 | U2.3 3.05,45.59 v3.05,44.45
  Bottom 0.305: U3.4 42.93,53.72 44.51,52.13 | U6.7 43.81,40.01 | 43.81,40.01 46.35,37.47 U6.4 46.99,37.41 46.99,36.83 46.44,36.28 C14.1 | U3.7 45.47,51.18 44.51,52.13 | 43.81,40.01 43.81,40.64 43.26,41.2 43.26,41.7 43.08,41.88 42.98,41.88 40.02,44.84 40.02,46.35 41.09,47.41 42.59,47.41 43.16,46.84 CURRENT1.P$1 | U5.4 41.85,34.26 42.17,34.58 C11.1 | U5.7 45.47,30.86 42.93,33.4 U5.4 | U4.7 42.55,19.68 45.09,17.14 | 45.09,17.14 45.72,17.14 | 45.72,17.14 U4.4 47.59,17.14 C8.1 | U14.6 19.27,51.44 C23.1 | C23.1 18.67,51.81 19.47,51.01 19.47,49.53 v19.57,49.43 | 45.09,17.14 45.09,16.73 44.87,16.51 v44.66,16.51 | U10.VCC 38.1,12.32 | 38.1,12.32 39.37,12.32 40.77,13.72 v40.77,16 | C23.1 20.61,53.98 U14.8 22.59,55.03 29.42,55.03 30.22,54.23 R29.2 | C17.1 C18.1 | v12.14,10.16 12.27,10.29 12.27,13.24 12.68,13.64 15.88,13.64 16.51,14.27 18.72,14.27 19.23,13.76 C22.1 19.74,13.68 U13.14 19.74,12.01 21.59,10.16 21.59,6.99 U12.16 U12.15 22.73,7.95 26.54,11.76 U12.5 | U9.1 15.09,41.38 15.24,41.53 | v40.02,26.67 40.02,32.4 40.64,33.02 | U5.4 41.02,33.4 40.64,33.02 | 44.51,52.13 v44.45,52.07 | U9.12 13.09,41.91 12.7,41.53 12.09,40.91 U9.7 U9.8 11.59,41.75 11.43,41.91 | v4.65,4.63 4.26,4.63 3.56,5.33 U7.3 | 38.1,12.32 38.1,11.64 R14.1 | 38.1,12.32 38.1,12.99 C20.1 | 45.72,17.14 45.72,7.89 Q2.3 | 10.03,43.31 10.93,43.31 U9.9 | v40.64,34.29 40.64,33.02 | v37.72,51.31 37.5,51.52 C5.1 | C17.1 12.14,7.48 v12.14,8.12 | C17.1 9.29,4.63 v8.76,4.63
  Bottom 0.61: U2.3 7.81,47.09 C4.1 10.01,44.97 10.01,43.33 10.03,43.31 11.43,41.91 11.81,41.53 12.7,41.53 15.24,41.53 17.02,41.53 17.4,41.91 v18.03,41.91 | v3.05,44.45 1.44,42.84 1.44,26.92 v1.69,26.67
+12V  (via drill 0.35, 0.65)
  Top 0.305: U16.16 53.13,6.35 v52.07,6.35 | MAIN.P$7 22.06,30.31 24.52,27.85 29.55,27.85 37.78,19.63 37.78,16.21 42.87,11.12 44,11.12 48.77,6.35 v49.53,6.35
  Top 0.61: POWER.P$1 2.03,35.82 | 2.03,35.82 2.03,41.91 | U2.1 3.91,52.17 2.03,50.29 2.03,41.91 | 2.03,35.82 2.03,28.45 ENERGYMETER.P$1 | v16.26,40.51 13.59,43.18 3.95,43.18 | 3.95,43.18 3.3,43.18 2.03,41.91 | MAIN.P$7 23.03,31.67 23.03,33.38 20.85,35.56 v20.32,35.56 | IMD.P$1 3.95,43.18
  Bottom 0.305: U1.8 22.07,40.81 C2.1 | v49.53,6.35 v52.07,6.35
  Bottom 0.61: U2.1 7.56,52.17 C3.1 | v20.32,35.56 19.3,36.58 C2.1 19.01,40.51 v16.26,40.51
BMS_OK_3.3V  (via drill 0.35)
  Top 0.305: v37.47,21.84 32.51,26.8 32.51,30.51 31.14,31.89 31.14,35.97 28.14,38.97 28.14,39.06 26.81,40.39 v26.81,40.64
  Bottom 0.305: U1.5 26.1,40.64 v26.81,40.64 | U8.4 37.15,14.04 37.15,15.54 37.47,15.86 v37.47,21.84
BMS_OK_10V  (via drill 0.35)
  Top 0.305: v20.32,36.83 16.02,32.53 16.02,28.33 19.04,25.31 MAIN.P$4 | v20.95,40.01 20.54,40.42 BMS-OK.A
  Bottom 0.305: R6.2 R3.1 27.19,44.63 24.44,44.63 24.03,44.22 24.03,41.5 U1.7 23.37,39.88 22.86,39.37 | 22.86,39.37 v20.32,36.83 | v20.95,40.01 21.59,39.37 22.86,39.37
BSPD_CURR_REFERENCE
  Bottom 0.305: U14.3 32.3,51.44 R30.2 35.14,48.59 R31.1
BSPD_CURR_SIGNAL  (via drill 0.35)
  Top 0.305: v29.07,48.12 26.05,48.12 v26.04,48.13 | v31.07,45.81 31.07,43.48 v32.64,41.91 | v24.13,31.75 25.4,33.02 25.4,34.77 v28.34,37.7
  Bottom 0.305: v29.07,48.12 31.37,45.81 31.37,45.72 31.16,45.72 v31.07,45.81 | v28.34,37.7 28.46,37.7 32.64,41.88 v32.64,41.91 | R29.1 28.49,53.98 U14.1 26.07,53.31 25.5,53.31 25.32,53.13 25.32,49.35 26.04,48.64 v26.04,48.13 | MAIN.P$3 20.47,29.11 20.47,30.81 21.18,31.52 23.9,31.52 v24.13,31.75
CANH  (via drill 0.35)
  Top 0.305: MAIN.P$10 20.47,21.61 18.68,21.61 17.91,22.37 ENERGYMETER.P$4 6.2,20.82 6.2,15.5 v5.51,14.81
  Bottom 0.305: ENERGYMETER.P$4 9.65,24.37 9.65,26.38 7.88,28.15 POWER.P$4 8.41,31.03 R1.2 | MAIN.P$10 21.99,23.13 U18.2 | U7.7 4.7,14 v5.51,14.81
CANL
  Top 0.305: MAIN.P$9 20.88,25.31 19.68,24.11 8.88,24.11 ENERGYMETER.P$3
  Bottom 0.305: 7.53,27.85 7.88,27.5 ENERGYMETER.P$3 | 7.53,27.85 6.59,28.8 6.59,31.7 POWER.P$3 9.18,34.29 9.23,34.29 9.23,35.77 9.24,35.77 R2.2 | U7.6 3.56,21.26 2.23,22.59 2.23,24.6 4.05,26.43 6.11,26.43 7.53,27.85 | U18.1 24.08,24.13 22.86,24.13 MAIN.P$9
CHARGE_ENABLE  (via drill 0.35)
  Top 0.305: v35.56,25.4 33.27,27.69 33.27,35.94 D1.C
  Bottom 0.305: MAIN.P$2 19.18,30.61 20.47,31.9 20.47,33.31 22.45,35.29 23.22,35.29 D1.C | v35.56,25.4 35.65,25.31 R25.1
CHARGE_ENABLE_TEENSY
  Bottom 0.305: D4.C 31.34,19.65 30.08,19.65 29.52,19.09 29.52,16.82 29.12,16.42 27.01,16.42 TEENSY3.2.A3
CS_LTC6820  (via drill 0.35)
  Top 0.305: v13.28,36.61 13.08,36.41 13.08,28.96 v13.72,28.32 | TEENSY3.2.D10(TX2) 25.52,7.75 19.47,7.75 14.28,12.94 14.28,18.61 12.95,19.94 v12.63,19.94
  Bottom 0.305: U9.5 13.09,36.8 v13.28,36.61 | v13.72,28.32 12.83,27.43 12.83,20.14 v12.63,19.94
CS_MCP3208_3.3V
  Bottom 0.305: TEENSY3.2.D9(RX2) 26.33,4.41 20.32,4.41 19.09,5.64 U13.2
CURR1_SENSE
  Bottom 0.305: U3.2 42.41,51.18 44.38,49.21 44.38,48.26 | CURRENT1.P$2 44.38,45.55 44.38,48.26 | 44.38,48.26 41.61,48.26 41.56,48.21 39.51,48.21 R10.1
CURR1_SENSE_FILTERED  (via drill 0.35)
  Top 0.305: v36.58,51.18 v36.58,48.26 | v49.53,45.72 46.95,43.14 39.41,43.14 v38.1,44.45 | v22.1,13.97 19.05,17.02 v19.05,20.32 | v24.52,35.19 24,34.67 v24,32.77
  Bottom 0.305: U14.2 35.05,52.7 v36.58,51.18 | v22.1,13.97 22.1,12.95 U12.1 | U3.5 50.42,53.72 50.8,53.34 50.8,46.99 v49.53,45.72 | v24.52,35.19 31.66,35.19 38.1,41.62 v38.1,44.45 36.58,45.97 v36.58,48.26 | v19.05,20.32 19.36,20.63 19.36,21.29 20.47,22.4 20.47,28.31 21.27,29.11 22.76,29.11 24.81,31.16 24.81,32.03 24.08,32.77 v24,32.77
CURR2_SENSE  (via drill 0.35)
  Top 0.305: v44.32,21.46 44.32,22.88 CURRENT2.P$2
  Bottom 0.305: v44.32,21.46 46.1,19.68 U4.2 | R11.1 46.98,24.42 46.18,25.23 44.38,25.23 CURRENT2.P$2
CURR2_SENSE_FILTERED  (via drill 0.35)
  Top 0.305: v30.1,10.41 30.86,9.65 30.87,9.65 32.65,7.87 v36.32,7.87
  Bottom 0.305: U4.5 42.59,16.4 42.59,12.29 38.17,7.87 v36.32,7.87 | U12.7 29.08,12.57 29.21,12.7 29.21,12.45 U12.7 | v30.1,10.41 29.08,11.43 U12.7
DISCHARGE_RELAY_GND  (via drill 0.65)
  Top 0.61: v43.66,12.57 42.32,12.57 38.39,16.51 38.39,30.48 39.37,31.46 39.37,32.62 38.33,33.66 RELAY.P$2 | v48.44,2.74 47.94,2.74 45.72,4.95 v45.72,5.08
  Bottom 0.61: D7.A 39.37,31.23 39.37,32.75 RELAY.P$2 | U15.COIL- 102.39,39.85 115.7,26.54 115.7,5.65 112.72,2.67 48.51,2.67 v48.44,2.74 | v43.66,12.57 43.66,7.14 v45.72,5.08
GND  (via drill 0.35)
  Top 0.305: R8.2 R9.2 27.05,37.81 v27.22,37.81 | R5.1 24.13,47.46 v24.13,48.26 | R13.2 44.84,5.47 v44.45,5.08 | U16.14 56.52,13.34 v51.69,8.51 | v15.24,21.69 v17.63,21.69 | v48.77,3.8 48.77,3.59
  Bottom 0.305: R11.2 47.75,25.9 48.56,25.1 48.56,23.75 48.38,23.57 47.99,23.57 47.77,23.35 47.52,23.35 C10.2 | 44.45,38.1 44.45,37.3 | U3.3 41.3,51.9 C7.2 | U8.3 36.38,16.85 36.52,16.98 36.52,19.83 R26.1 | C14.2 47.07,34.58 C13.2 47.38,34.67 48.18,35.48 49.53,35.48 49.71,35.3 49.71,31.69 48.28,30.26 44.55,30.26 45.82,28.99 47,28.99 48.13,27.85 C12.2 | v51.69,8.51 51.38,8.51 50.7,7.83 50.14,7.83 49.94,8.03 49.53,8.03 49.51,8.01 48.68,8.01 48.02,7.34 48.02,5.82 47.84,5.64 47.55,5.64 45.72,3.81 v44.45,5.08 | R4.2 15.24,22.64 v15.24,21.69 | R42.2 50.06,3.8 v48.77,3.8 | U9.13 13.59,45.09 14.09,44.59 U9.14 14.1,43.95 14.1,43.18 13.59,43.18 U9.13
  Bottom 0.61: C10.2 45.68,22.94 CURRENT2.P$4 | C16.2 45.68,43.64 CURRENT1.P$4
  pour Bottom: 1.27,1.27 50.8,1.27 50.8,54.61 1.27,54.61
  pour Top: 1.27,48.64 1.27,1.27 46.99,1.27 46.99,48.64
  pour Top: 36.83,52.07 50.8,52.07 50.8,27.94 36.83,27.94
  pour Top: 1.27,50.8 19.05,50.8 19.05,43.18 1.27,43.18
  pour Top: 45.72,1.27 50.8,1.27 50.8,8.89 43.18,8.89 43.18,1.27
HV+FUSED_1A
  Bottom 0.813: 84.44,67.31 HV+FUSED_1A-IMD+.P$4 | HV+FUSED_1A-IMD+.P$3 81.94,66.89 | 84.44,67.31 82.36,67.31 81.94,66.89 | 81.94,66.89 HV+FUSED_1A-IMD+.P$1 81.09,66.04 80.5,65.45 80.5,51.04 78.74,49.28 | HV+FUSED_1A-IMD+.P$2 84.44,67.31 | U17.1 78.74,49.28 | R34.2 83.82,49.28 78.74,49.28
HV+UNFUSED
  Top 0.813: HV+UNFUSED.P$2 92.56,14.44 91.37,15.62 C24.P$1
  Bottom 0.813: 95.09,14.13 95.42,14.45 U15.CONTACT1 | 95.09,14.13 94.84,13.87 93.12,13.87 92.56,14.44 HV+UNFUSED.P$2 | HV+UNFUSED.P$1 95.09,14.47 95.09,14.13
HV+UNFUSED_FSAE_DISCHARGE
  Bottom 0.813: 94.94,68.58 101.6,68.58 104.93,65.25 U15.CONTACT2 | 94.94,68.58 93.82,69.7 92.71,69.7 92.09,69.08 DISCH+.P$1 | DISCH+.P$2 94.94,68.58
HV-FUSED_1A  (via drill 0.9)
  Top 0.813: 71.78,67.31 HV-FUSED_1A-IMD-.P$3 | 77.47,59.69 v77.47,54.61 v77.47,33.02 | v72.39,25.65 71.12,24.38 71.12,16.51 69.85,15.24 66.88,15.24 | U16.9 57.58,22.23 62.23,26.88 62.23,58.42 63.5,59.69 77.47,59.69 | U16.5 66.88,15.24 | 66.88,15.24 U16.4 | 71.78,67.31 73.85,67.31 74.28,66.89 HV-FUSED_1A-IMD-.P$4 HV-FUSED_1A-IMD-.P$2 76.2,66.04 77.47,64.77 77.47,59.69 | HV-FUSED_1A-IMD-.P$1 71.78,67.31
  Bottom 0.813: R37.1 83.58,30.48 76.88,30.48 76.2,29.8 | v77.47,33.02 76.2,31.75 76.2,29.8 | Q1.2 76.47,26.35 76.2,26.35 | 76.2,26.35 76.2,29.8 | v72.39,25.65 73.09,26.35 76.2,26.35 | R38.2 v77.47,54.61
HV-UNFUSED
  Bottom 0.813: 61.62,67.31 HV-UNFUSED_DISCHARGE-.P$3 | HV-UNFUSED_DISCHARGE-.P$4 64.11,67.31 | 64.11,67.31 61.62,67.31 | 61.62,67.31 HV-UNFUSED_DISCHARGE-.P$1 60.45,66.04 59.69,65.28 59.69,63.5 60.96,62.23 60.96,20.88 66.22,15.62 C24.P$2 | HV-UNFUSED_DISCHARGE-.P$2 64.11,67.31
IM  (via drill 0.35)
  Top 0.305: v11.43,52.07 11.43,55.88 11.02,56.29 11.02,61.37 12.08,62.42 U11.P$10
  Bottom 0.305: U9.10 12.09,51.41 v11.43,52.07
IP  (via drill 0.35)
  Top 0.305: U11.P$12 12.7,58.43 v12.7,52.07
  Bottom 0.305: v12.7,52.07 12.59,51.96 U9.11
ISOSPI-M
  Top 0.305: ISO_SPI.P$2 31.01,64.03 R20.2 30.2,62.42 U11.P$3
ISOSPI-P
  Top 0.305: ISO_SPI.P$1 33.11,65.77 R20.1 33.11,62.12 29.41,58.42 U11.P$1
MISO  (via drill 0.35)
  Top 0.305: v14.54,37.47 14.54,27.88 14.1,27.43 v13.97,27.43 | v13.54,20.32 13.58,20.28 15,20.28 16.82,18.46 16.82,11.55 19.71,8.66 v25.4,8.66 28.98,5.08 33.27,5.08 TEENSY3.2.D12
  Bottom 0.305: TEENSY3.2.D12 R19.2 | v14.54,37.47 14.09,37.92 U9.3 | v25.4,8.66 26.54,7.52 U12.12 | v13.54,20.32 13.54,26.67 13.97,27.1 v13.97,27.43
MOSI_5V  (via drill 0.35)
  Top 0.305: v17.51,13.59 17.73,13.36 17.73,13.31 21.69,9.35 26.21,9.35 v26.67,8.89
  Bottom 0.305: U12.11 27.81,7.75 v26.67,8.89 | U13.10 17.26,12.56 17.26,13.12 17.51,13.37 v17.51,13.59
MOSI_TEENSY  (via drill 0.35)
  Top 0.305: v16.29,9.94 16.29,10.2 13.72,12.76 13.72,16.38 v13.6,16.51
  Bottom 0.305: R18.2 TEENSY3.2.D11 32.49,2.79 30.88,1.18 17.38,1.18 16.82,1.74 16.82,5.09 17.14,5.4 U13.5 17.02,7.03 17.02,9.54 16.45,10.1 v16.29,9.94 | U9.2 14.59,38.49 15.24,37.84 15.24,24.45 14.22,23.43 14.22,17.13 v13.6,16.51
N$1  (via drill 0.9)
  Top 0.813: v81.28,22.86 94.69,22.86 96.05,24.22 96.05,25.93 95.57,26.42 INDICATOR.P$2
  Bottom 0.813: Q1.3 81.01,22.86 v81.28,22.86
N$2  (via drill 0.35)
  Top 0.305: v48.77,51.44 46.29,48.96 40.96,48.96 v40.89,48.9
  Bottom 0.305: v48.77,51.44 48.77,52 48.32,52.45 U3.6 | C7.1 39.79,49.91 40.64,49.91 | U3.1 40.64,49.91 | v40.89,48.9 40.89,49.66 40.64,49.91
N$3
  Top 0.305: R9.1 ON-LED.C
N$4
  Bottom 0.305: U3.8 48.26,49.91 48.86,49.31 C6.1
N$7  (via drill 0.35)
  Top 0.305: v18.41,13.59 18.41,13.44 21.77,10.08 v27.18,10.08
  Bottom 0.305: U13.13 19.01,12.52 19.01,13.34 18.75,13.59 v18.41,13.59 | U12.10 29.08,7.37 29.05,7.4 29.05,9.23 28.45,9.83 27.43,9.83 v27.18,10.08
N$8
  Bottom 0.305: R21.2 R22.2 30.83,22.74 D2.A
N$9
  Bottom 0.305: R26.2 R25.2 32.65,22.73 D4.A
N$10
  Bottom 0.305: R32.2 41.49,3.38 R33.2 39.42,4.71 D6.A
N$11
  Bottom 0.305: C1.2 10.16,33.95 R2.1 R1.1
N$12
  Bottom 0.305: U1.6 24.64,41.4 25.57,42.33 26.67,42.33 R6.1 R7.2
N$13
  Bottom 0.305: R23.2 R24.2 30.73,26.71 D3.A
N$14
  Bottom 0.813: R34.1 R35.1
N$15  (via drill 0.9)
  Top 0.813: v73.91,42.67 73.79,42.8 73.79,47.12 v68.32,52.59
  Bottom 0.813: v68.32,52.59 67.56,53.35 R39.1 | R40.1 73.42,42.17 v73.91,42.67 74.93,43.69 U17.3
N$16  (via drill 0.9)
  Top 0.813: U16.2 U16.1 66.88,9.32 67.31,8.89 78.74,8.89 80.08,10.23 80.08,19.61 81.75,21.28 86.32,21.28 v86.63,20.97
  Bottom 0.813: R35.2 85.09,40.64 86.11,39.62 | 86.11,39.62 88.66,39.62 89.66,38.61 89.66,21.59 89.03,20.95 86.64,20.95 v86.63,20.97 | 86.11,39.62 85.09,38.59 R36.2
N$17
  Bottom 0.813: R37.2 R36.1
N$20  (via drill 0.35)
  Top 0.305: U16.15 57.07,12.06 v52.36,7.35
  Bottom 0.305: Q2.1 49.31,7.35 v52.36,7.35
N$21
  Bottom 0.305: R28.2 7.96,15.62 R27.2 10.48,15.17 10.29,14.98 D5.A
N$22  (via drill 0.9)
  Top 0.813: U16.10 61.59,18.41 v65.02,21.84
  Bottom 0.813: Q1.1 76.66,22.1 65.28,22.1 v65.02,21.84
N$23  (via drill 0.9)
  Top 0.813: INDICATOR.P$1 89.94,29.21 67.56,29.21 v67.31,28.96 66.88,28.53 U16.8 65.41,19.68 63.5,17.78 63.5,17.14 | U16.6 63.5,17.14 | U16.3 63.12,13.34 63.12,17.14 | U16.11 63.12,17.14 | 63.12,17.14 63.5,17.14
  Bottom 0.813: U17.2(TAB) 67.56,46.53 67.56,40.65 R41.2 67.56,29.2 v67.31,28.96
N$25
  Bottom 0.305: TEENSY3.2.D3(CANTX) 12.17,2.79 10.56,1.18 7.22,1.18 6.66,1.74 6.66,3.22 6.1,3.79 6.1,3.8 5.97,3.92 U7.1
N$26
  Bottom 0.305: R12.2 7.08,11.49 U7.8
N$29
  Top 0.305: TEENSY.C 41.29,6.39 41.33,6.35 R13.1
N$31
  Bottom 0.305: U9.16 16.47,45.34 R16.1
N$32
  Bottom 0.305: R17.1 R16.2 14.77,45.94 14.63,45.8 14.63,44 U9.15
N$35  (via drill 0.35)
  Top 0.305: U11.P$11 13.88,60.42 v14.61,59.69
  Bottom 0.305: v14.61,59.69 14.99,59.31 C19.1
N$36  (via drill 0.35)
  Top 0.305: TEENSY3.2.D4(CANRX) 13.63,1.18 6.22,1.18 v6.01,1.39
  Bottom 0.305: v6.01,1.39 5.8,1.18 4.68,1.18 3.81,2.05 3.81,3.81 2.29,5.33 U7.4
N$37
  Top 0.305: TEENSY.A 39.18,6.4 36.77,3.99 36.77,2 35.96,1.18 25,1.18 23.39,2.79 TEENSY3.2.D7(RX3)
N$38  (via drill 0.35)
  Top 0.305: v36.17,11.13 35.43,11.86 v35.43,14.86
  Bottom 0.305: v36.17,11.13 U10.WDO 36.46,9.82 R14.2 | U8.2 v35.43,14.86
N$40
  Bottom 0.305: U8.1 34.04,16.42 32.62,16.42 31.01,18.03 TEENSY3.2.A1
N$42  (via drill 0.35)
  Top 0.305: v19.05,45.72 20.29,45.72 IMD-OK.A
  Bottom 0.305: U1.2 U1.1 19.36,46.03 v19.05,45.72
N$43
  Bottom 0.813: R41.1 R40.2
N$44
  Top 0.305: BMS-OK.C R8.1
N$45
  Top 0.305: R5.2 IMD-OK.C
N$47
  Bottom 0.813: R38.1 R39.2
N$48  (via drill 0.35)
  Top 0.305: v49.02,39.75 47.77,38.5 v39.61,38.5
  Bottom 0.305: v39.61,38.5 41.61,38.5 U6.6 | v49.02,39.75 49.02,39.88 48.48,40.42 48.48,42.55 C16.1 48.22,42.38 47.11,41.27 U6.1
N$49
  Bottom 0.305: U6.8 41.74,41.27 C15.1
N$50  (via drill 0.35)
  Top 0.305: TEENSY3.2.A0 33.02,13.97 v31.37,12.32
  Bottom 0.305: v31.37,12.32 32.04,12.99 R15.1 33.56,12.99 34.08,12.48 34.11,12.48 U10.WDI
N$51  (via drill 0.35)
  Top 0.305: v45.34,21.46 41.91,18.03 v39.75,18.03
  Bottom 0.305: C10.1 47.05,21.18 U4.1 45.85,20.95 v45.34,21.46 | v39.75,18.03 41.47,18.03 U4.6
N$52
  Bottom 0.305: C9.1 41.81,20.92 U4.8
N$53  (via drill 0.35)
  Top 0.305: v48.9,32.13 45.47,28.7 v41.78,28.7
  Bottom 0.305: C13.1 48.88,34.65 48.88,32.15 v48.9,32.13 U5.6 | v41.78,28.7 41.78,29.52 U5.1
N$54
  Bottom 0.305: U5.8 49.18,29.59 C12.1
OKHS  (via drill 0.35)
  Top 0.305: v17.73,44.45 17.19,43.91 17.19,39.93 v16.51,39.24 IMD.P$5
  Bottom 0.305: MAIN.P$5 R4.1 | U1.3 23.97,45.37 23.97,44.81 23.61,44.45 v17.73,44.45 | R27.1 12.11,15.83 15.04,15.83 16.26,17.04 16.26,21.07 16.78,21.59 R4.1 | v16.51,39.24 16.51,30.33 16.02,29.84 16.02,24.89 16.78,24.13 R4.1
OKHS_TEENSY  (via drill 0.35)
  Top 0.305: TEENSY3.2.A7 v15.24,15.14
  Bottom 0.305: v15.24,15.14 13.97,15.14 13.64,14.82 11.43,14.82 11.19,14.58 11.19,13.07 10.29,12.17 D5.C
REF1_SENSE
  Bottom 0.305: CURRENT1.P$3 45.68,46.05 44.48,44.84 44.48,40.8 45.27,40.01 U6.2
REF1_SENSE_FILTERED  (via drill 0.35)
  Top 0.305: 34.16,41.4 31.75,43.81 v31.75,48.26 | 34.16,41.4 v33.27,40.51 | v24.46,14.61 26.98,17.13 26.98,21.51 27.35,21.88 27.35,25.68 26.71,26.33 v26.54,26.33 | v31.88,32.77 31.88,36.2 v30.23,37.85 | 34.16,41.4 v37.59,37.97
  Bottom 0.305: U6.5 38.1,37.47 v37.59,37.97 | v31.75,48.26 R31.2 | v30.23,37.85 32.89,40.51 v33.27,40.51 | U12.2 22.73,12.88 v24.46,14.61 | v26.54,26.33 26.54,27.85 26.51,27.89 28.93,30.31 29.8,30.31 31.88,32.38 v31.88,32.77
REF2_SENSE
  Bottom 0.305: CURRENT2.P$3 45.68,27.59 42.41,30.86 U5.2
REF2_SENSE_FILTERED  (via drill 0.35)
  Top 0.305: v45.34,32.89 45.42,32.81 49.18,32.81 49.58,32.41 49.58,31.59 46.99,29.01 46.99,22.86 46.02,21.89 46.02,20.62 45.72,20.32 45.72,16.51 45.75,16.48 44.45,15.18 v41.91,15.18 | v40.01,10.79 39.37,10.16 v32.51,10.16
  Bottom 0.305: v32.51,10.16 U12.8 | U5.5 46.54,32.89 v45.34,32.89 | v40.01,10.79 41.91,12.7 v41.91,15.18
SCK_5V
  Bottom 0.305: U13.11 17.79,11.43 20.32,8.9 20.32,5.98 20.85,5.45 24.5,5.45 25.27,6.22 U12.13
SCK_TEENSY  (via drill 0.35)
  Top 0.305: v17.78,5.08 17.78,5.86 6.66,16.98 6.66,19.09 8.58,21 11.68,21 | 11.68,21 19.36,21 21.59,18.77 21.59,16.51 26.67,11.43 31.5,11.43 34.04,13.97 34.04,16.51 TEENSY3.2.D13 | v11.68,20.32 11.68,21
  Bottom 0.305: U13.4 v17.79,5.09 v17.78,5.08 | U9.4 13.59,37.26 13.96,36.89 13.96,29.53 12.02,27.59 12.02,20.65 v11.68,20.32
SHUTDOWN_G  (via drill 0.35)
  Top 0.305: INTERLOCK.P$1 26.45,33.66 26,33.2 26,32.07 30.12,27.94 v31.75,27.94
  Bottom 0.305: R21.1 30.2,24.14 30.97,24.14 31.75,24.92 v31.75,27.94
  Bottom 0.61: MAIN.P$6 22.52,33.66 INTERLOCK.P$1
SHUTDOWN_G_TEENSY
  Bottom 0.305: TEENSY3.2.A5 22.44,20.15 30.07,20.15 D2.C
SHUTDOWN_H  (via drill 0.35, 0.65)
  Top 0.61: D1.A v50.81,40.64 | v50.67,9.14 50.55,9.02 50.55,1.9 50.8,1.65 v50.93,1.65
  Bottom 0.305: R23.1 29.63,29.34 D7.C
  Bottom 0.61: D1.A 38.1,40.64 35.56,38.1 35.56,34.06 35.86,33.75 | v50.93,1.65 51.25,1.32 113.03,1.32 116.53,4.83 116.53,34.49 111.17,39.85 U15.COIL+ | D7.C 35.68,30.35 34.6,31.42 34.6,32.5 35.86,33.75 | v50.81,40.64 50.81,9.28 v50.67,9.14 | INTERLOCK.P$2 RELAY.P$1 35.86,33.75
SHUTDOWN_H_TEENSY  (via drill 0.35)
  Top 0.305: v26.67,24.13 26.67,21.84 TEENSY3.2.A4
  Bottom 0.305: D3.C 30.75,25.26 30.28,24.8 30.28,24.77 30.1,24.59 27.14,24.59 v26.67,24.13

### Text on the board
tNames: IMD | POWER | METER | ENERGY
tDocu: GLV | isoSPI | isoSPI | GLV | GLV | TS | TS | GLV | DISCHARGE+ | UNFUSED- / DISCHARGE- | FUSED- / IMD- | FUSED+ / IMD+ | isoSPI | GLV | TS | DANGER / HIGH VOLTAGE | GLV | GLV | TS | TS | GLV | 2020 HV Board rev12 / Designed by Arvind Srinivasan, / based on rev11 by Yvonne Yeh | TRACTIVE SYSTEM / PCB AREA | INDICATOR | GLV | TS | GLV | TS | TS | GLV | UNFUSED+ | Grounded Low / Voltage PCB Area
bDocu: GLV | isoSPI | isoSPI | GLV | GLV | TS | TS | GLV | isoSPI | GLV | TS | DANGER / HIGH VOLTAGE | GLV | GLV | TS | TS | GLV | TRACTIVE SYSTEM / PCB AREA | GLV | TS | GLV | TS | TS | GLV | Grounded Low / Voltage PCB Area